# Altium schematic sheet POWER_GATEWAY.SchDoc
size A4
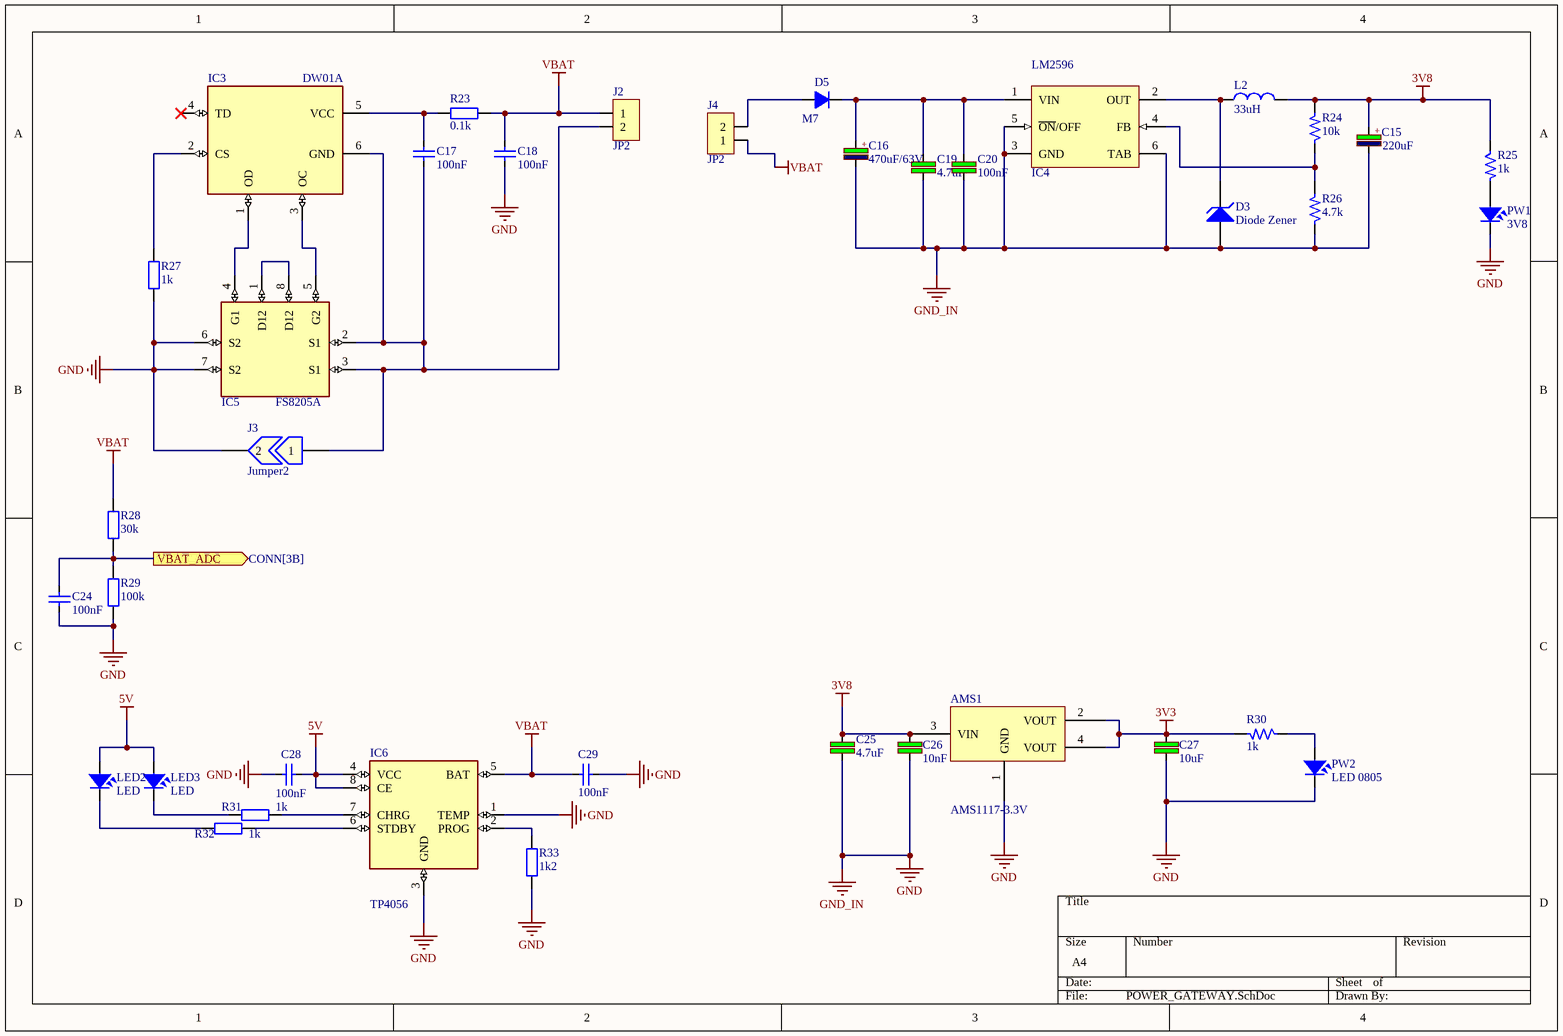
[diagram p0: POWER_GATEWAY.SchDoc]

## Parts
AMS1  AMS1117-3.3V  [SOT223]
C15  220uF  [CAP_TANTALUM_3216]
C16  470uF/63V  [CAP-ALU-SMD-C]
C17  100nF  [CAP_0805]
C18  100nF  [CAP_0805]
C19  4.7uF  [C-0805]
C20  value 100nF  [C-0805]  (hidden comment: 4.7uF)
C24  100nF  [CAP_0805]
C25  4.7uF  [C-0805]
C26  10nF  [C-0805]
C27  10uF  [C-0805]
C28  100nF  [CAP_0805]
C29  100nF  [CAP_0805]
D3  Diode Zener  [DIODE_ZENER_SMD]
D5  M7  [SMA]
IC3  DW01A  [SOT23-6]
IC4  LM2596  [TO-263]
IC5  FS8205A  [FS8205A]
IC6  TP4056  [TP4056]
J2  JP2  [KF2-5.08]
J3  Jumper2  [JUMPER2]
J4  JP2  [KF2-5.08]
L2  33uH  [Inductor_SMD]
LED2  LED  [LED-0805-Blue]
LED3  LED  [LED-0805-Blue]
PW1  3V8  [LED-0805-Blue]
PW2  LED 0805  [LED-0805-Blue]
R23  0.1k  [RES-SMD-0805]
R24  10k  [R-0805]
R25  1k  [R-0805]
R26  4.7k  [R-0805]
R27  1k  [RES-SMD-0805]
R28  30k  [RES-SMD-0805]
R29  100k  [RES-SMD-0805]
R30  1k  [R-0805]
R31  1k  [RES-SMD-0805]
R32  1k  [RES-SMD-0805]
R33  1k2  [RES-SMD-0805]

## Ports
VBAT_ADC (out, see CONN[3B])

## Nets
3V3: AMS1.2(VOUT) AMS1.4(VOUT) C27.1 R30.2
3V8: AMS1.3(VIN) C15.1 C25.2 C26.1 L2.2 R24.2 R25.1
5V: C28.1 IC6.4(VCC) IC6.8(CE) LED2.1 LED3.1
GND: AMS1.1(GND) C15.2 C16.2 C18.1 C19.1 C20.1 C24.1 C25.1 C26.2 C27.2 C28.2 C29.1 D3.1(A) IC4.3(GND) IC4.5(~{ON}/OFF) IC4.6(TAB) IC5.6(S2) IC5.7(S2) IC6.1(TEMP) IC6.3(GND) J3.2 PW1.2 PW2.2 R26.1 R27.2 R29.1 R33.2  [also labelled GND_IN]
VBAT: C18.2 C29.2 IC6.5(BAT) J2.1 J4.1 R23.2 R28.2
VBAT_ADC: C24.2 R28.1 R29.2 ; port VBAT_ADC
NetC16_1: C16.1 C19.2 C20.2 D5.2(K) IC4.1(VIN)
NetC17_1: C17.1 IC3.6(GND) IC5.2(S1) IC5.3(S1) J2.2 J3.1
NetC17_2: C17.2 IC3.5(VCC) R23.1
NetD3_2: D3.2(K) IC4.2(OUT) L2.1
NetD5_1: D5.1(A) J4.2
NetIC3_1: IC3.1(OD) IC5.4(G1)
NetIC3_2: IC3.2(CS) R27.1
NetIC3_3: IC3.3(OC) IC5.5(G2)
NetIC4_4: IC4.4(FB) R24.1 R26.2
NetIC5_1: IC5.1(D12) IC5.8(D12)
NetIC6_2: IC6.2(PROG) R33.1
NetIC6_6: IC6.6(STDBY) R32.2
NetIC6_7: IC6.7(CHRG) R31.2
NetLED2_2: LED2.2 R32.1
NetLED3_2: LED3.2 R31.1
NetPW1_1: PW1.1 R25.2
NetPW2_1: PW2.1 R30.1

Not connected (* = marked no-connect by the designer): IC3 4(TD)*

## Notes on the sheet
- (in symbol CP3) +
- (in symbol CP5) +

## Library data of the parts
AMS1 = AMS1117 SMD: Dán; Value: AMS1117-3.3V SOT223; Don_Vi: Con; Ma_Hang: MH000596; Ghi_Chu: *; Kieu_Chan: *; Chung_Loai: Dán
C15 = CP5: 220µF Molded Tantalum Polymer Capacitor 16V 2917 (7343 Metric) 40mOhm @ 100kHz; Manufacturer: AVX Corporation; Part number: TCME227M016R0040E; User_Description: CAP TANT POLY 220UF 16V 2917; Value: 220uF; Category: CAPACITOR; Package: 2917
C16 = CP3: Cap 470uF/63V; Value: Cap 470uF/63V
C17 C18 C24 C28 C29 = CapSMD: Capacitor; Value: 33p; Published: 8-Jun-2000; LatestRevisionDate: 17-Jul-2002; LatestRevisionNote: Re-released for DXP Platform.; PackageReference: RAD-0.3; Publisher: Altium Limited
C19 C20 C25 = C: 4.7µF ±10% 35V Ceramic Capacitor X5R 0805 (2012 Metric); Manufacturer: Samsung Electro-Mechanics; Part number: CL21A475KLCLQNC; User_Description: CAP CER 4.7UF 35V X5R 0805; Category: CAPACITOR; Package: 0805
  C19 C25: Value: 4.7uF
C26 = C: Cap SMD; Manufacturer: Samsung Electro-Mechanics; Part number: CL21A106KPFNNNG; Value: 10uF; User_Description: CAP CER 10UF 10V X5R 0805; Category: CAPACITOR; Package: 0805
C27 = C: Cap SMD; Manufacturer: Samsung Electro-Mechanics; Part number: CL21A106KPFNNNG; User_Description: CAP CER 10UF 10V X5R 0805; Value: 10uF; Category: CAPACITOR; Package: 0805
D3 = Diode Zener: Zener Diode; Published: 8-Jun-2000; LatestRevisionDate: 17-Jul-2002; LatestRevisionNote: Re-released for DXP Platform.; PackageReference: DIODE-0.7; Publisher: Altium Limited
D5 = D1A: Diode 1A; Value: 1N4007
IC3 = DW01A: One Cell Lithium-ion/Polymer Battery Protection IC
IC4 = LM2576
IC6 = TP4056: Complete single cell Li-Ion battery with a constant current / constant voltage linear charger
J2 J4 = JP2: WR-PHD 2.54 mm Angled Socket Header; Manufacturer: W¨¹rth Elektronik eiSos GmbH; partNo: 613002143121; ComponentLink1 Description: Manufacturer; ComponentLink2 Description: Datasheet; NoPins: 02; Created Date: 29 March 2013; ComponentLink1URL: http://www.we-online.com; ComponentLink2URL: http://katalog.we-online.de/em/datasheet/6130xx143121.pdf; Created by: Karrer Zheng
J3 = Jumper2: Jumper, 2-Pin
L2 = L1: 22µH Shielded Inductor 1.65A 96mOhm Max Nonstandard; Manufacturer: Bourns Inc.; Part Number: SRR0745A-220M; Value: 220uH; User_Description: FIXED IND 22UH 1.65A 96 MOHM SMD; Category: INDUCTORS; Package: SMD
LED2 LED3 = LED: LED Single colour Green and Red; Value: LED 3 ly Single Colour
PW1 PW2 = LED: LED RED DIFFUSED 0805 SMD; Manufacturer: OSRAM Opto Semiconductors Inc.; Part number: LS R976-NR-1; Value: Red; Category: LED SMD; Package: 0805; User_Description: LED RED DIFFUSED 0805 SMD
R23 R27-R29 R31-R33 = Resistor - SMD: Resistor SMD; Manufacturer: Generic Components; Class: Passive; Published: 08/06/2000; Publisher: Altium Hobart Technology Centre
R24 = R: RES SMD 10K OHM 1% 1/8W 0805; Manufacturer: Yageo; Part number: RC0805FR-0710KL; Category: RESISTORS; Package: 0805; User_Description: RES SMD 10K OHM 1% 1/8W 0805; Value: 10k
R25 R30 = R: Resistor 1/4W; Manufacturer: Yageo; Part number: RC0805FR-071KL; User_Description: RES SMD 1K OHM 1% 1/8W 0805; Value: 1k; Category: RESISTORS; Package: 0805
R26 = R: RES SMD 3.3K OHM 1% 1/8W 0805; Manufacturer: Yageo; Part number: RC0805FR-073K3L; Category: RESISTORS; Package: 0805; User_Description: RES SMD 3.3K OHM 1% 1/8W 0805; Value: 3.3k